# EAGLE design MD_digital2 (EAGLE 6.2)
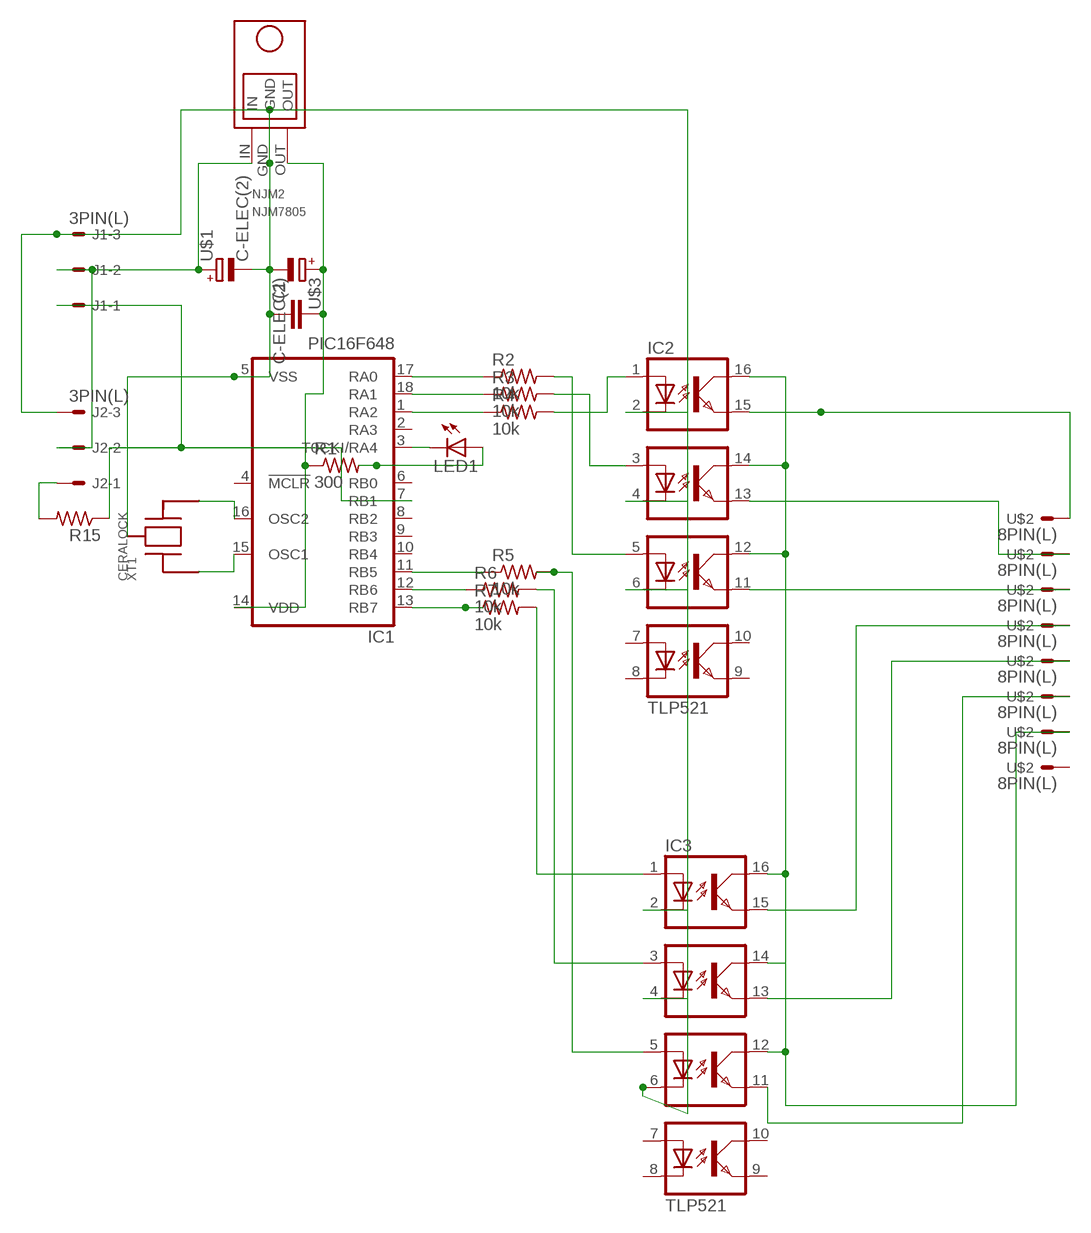
[diagram p0: schematic, sheet 1]

## Parts
C1  C-  [C-2.54]
IC1  PIC16F648  [DIL18]
IC2  TLP521  [DIL16]
IC3  TLP521  [DIL16]
J1  3PIN(L)  [3PL]
J2  3PIN(L)  [3PL]
LED1  LED  [LED5MM]
NJM2  NJM7805  [NJM7805]
R1  300  R-  [0207/10]
R2  10k  R-  [0207/10]
R3  10k  R-  [0207/10]
R4  10k  R-  [0207/10]
R5  10k  R-  [0207/10]
R6  10k  R-  [0207/10]
R7  10k  R-  [0207/10]
R15  R-  [0207/10]
U$1  C-ELEC(2)  [C-6MM(2)]
U$2  8PIN(L)  [8PL]
U$3  C-ELEC(2)  [C-6MM(2)]
XT1  CERALOCK  [CERALOCK]

## Nets
5V: C1.P$2 IC1.14(VDD) NJM2.OUT R1.1 U$3.+
9V: J1.2 J2.2 NJM2.IN U$1.+
12V: IC2.12(COL2) IC2.14(COL1) IC2.16(COL0) IC3.12(COL2) IC3.14(COL1) IC3.16(COL0) U$2.P7
FET_G2: IC3.11(EMIT2) U$2.P6
GND1: C1.P$1 IC1.5(VSS) IC2.2(C0) IC2.4(C1) IC2.6(C2) IC3.2(C0) IC3.4(C1) IC3.6(C2) J1.3 J2.3 NJM2.GND U$1.- U$3.- XT1.P2
LED_A: LED1.A R1.2
LED_C: IC1.3(T0CKI/RA4) LED1.K(C)
N$1: IC1.16(OSC2) XT1.P3
N$3: IC2.11(EMIT2) U$2.P3
N$4: J2.1 R15.2
N$7: IC1.15(OSC1) XT1.P1
N$10: IC1.17(RA0) R2.1
N$11: IC1.18(RA1) R3.1
N$12: IC1.1(RA2) R4.1
N$13: IC1.13(RB7) R7.1
N$14: IC1.12(RB6) R6.1
N$15: IC1.11(RB5) R5.1
N$16: IC2.5(A2) R2.2
N$17: IC2.3(A1) R3.2
N$18: IC2.1(A0) R4.2
N$19: IC3.1(A0) R7.2
N$20: IC3.3(A1) R6.2
N$21: IC3.5(A2) R5.2
N$23: IC2.15(EMIT0) U$2.P1
N$24: IC2.13(EMIT1) U$2.P2
N$25: IC3.15(EMIT0) U$2.P4
N$26: IC3.13(EMIT1) U$2.P5
SIGNAL: IC1.7(RB1) J1.1 R15.1
Unconnected: IC1.2(RA3) IC1.4(!MCLR) IC1.6(RB0) IC1.8(RB2) IC1.9(RB3) IC1.10(RB4) IC2.7(A3) IC2.8(C3) IC2.9(EMIT3) IC2.10(COL3) IC3.7(A3) IC3.8(C3) IC3.9(EMIT3) IC3.10(COL3) U$2.P8

## Library data of the parts
C1 = My_rcl:C-
IC1 = FP-21T for MITS:PIC16F648
IC2 IC3 = FP-21T for MITS:TLP521
J1 J2 = my_connector:3PIN(L)
LED1 = my_led:LED: LED
NJM2 = My_NJM7805:NJM7805
R1-R7 R15 = My_rcl:R-: Resistor
U$1 U$3 = My_rcl:C-ELEC(2)
U$2 = my_connector:8PIN(L)
XT1 = ceralock:CERALOCK

## Board
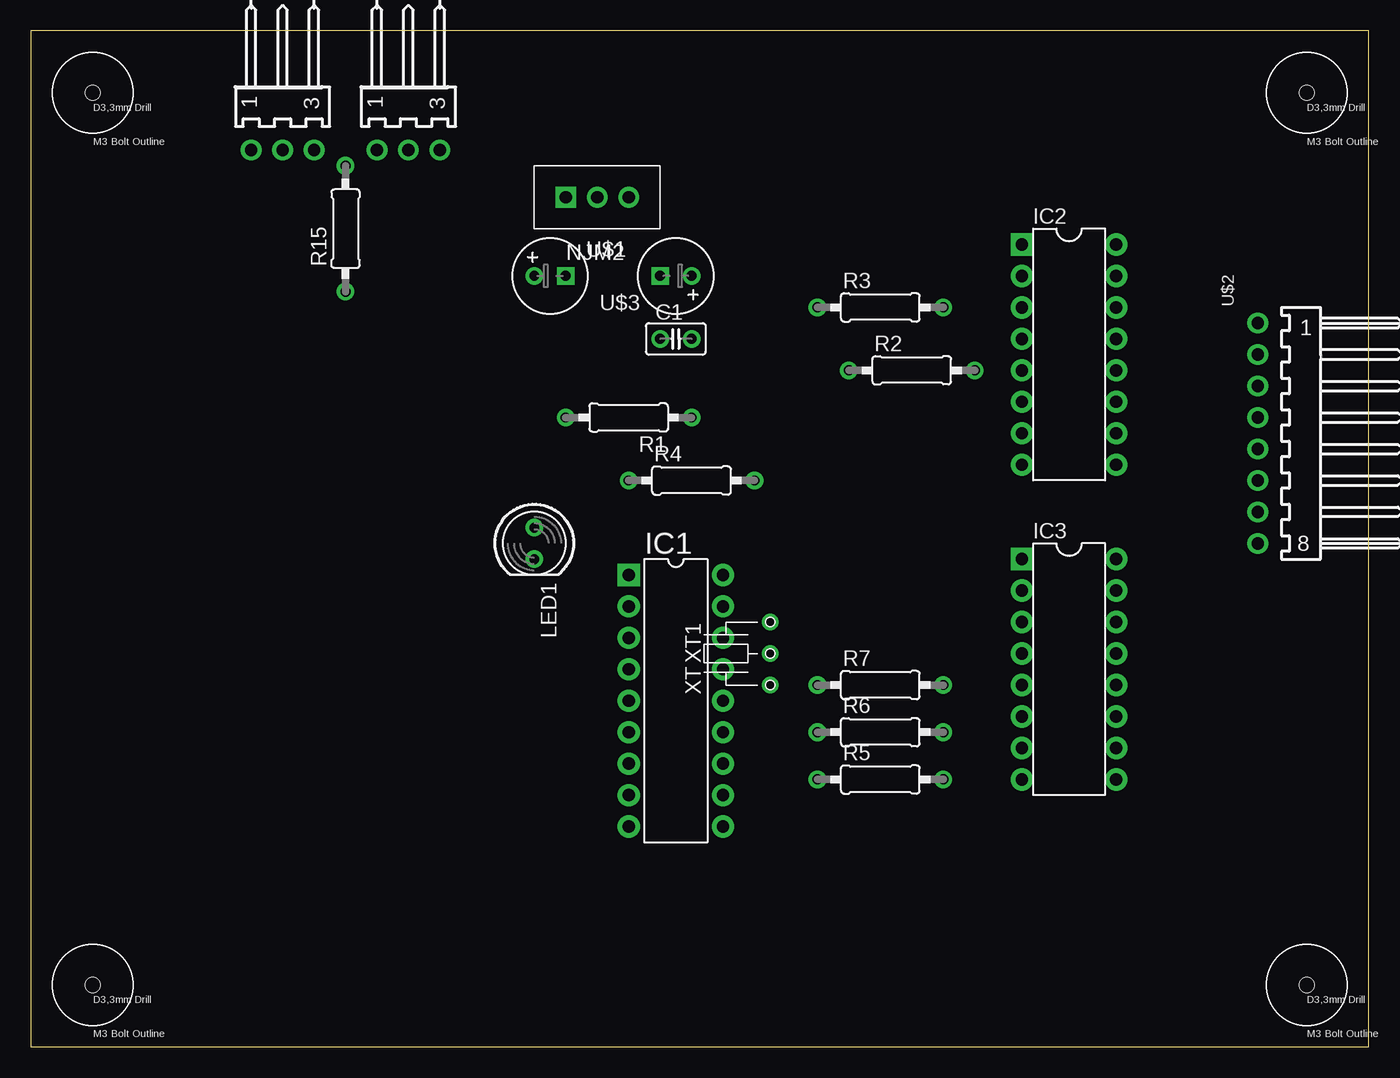
[diagram p1: board, top side]
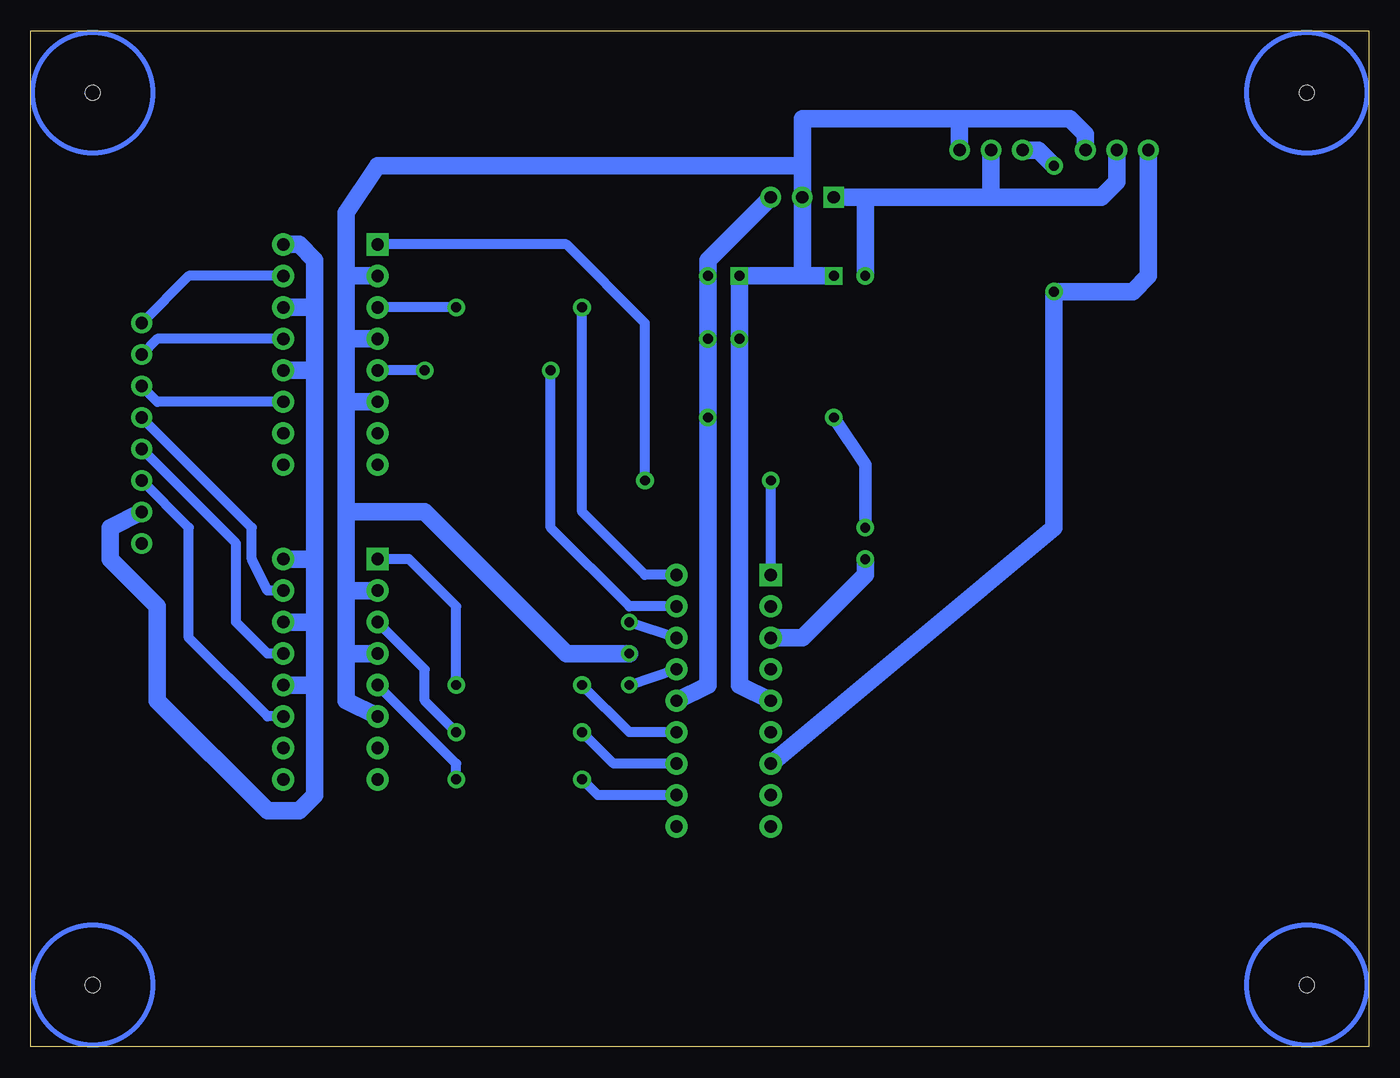
[diagram p2: board, bottom side, seen from below]

Size 108 x 82 mm. Coordinates in mm from the lower left corner, seen from the top.
Outline: 0,0 108,0 108,82 0,82 0,0
Copper layers (1*16): Top 0.035mm / dielectric 1.5mm / Bottom 0.035mm
Design rules: minimum track width 10mil, minimum drill 24mil, track to track 8mil, track to pad 8mil, pad to pad 8mil, via to via 8mil, smd to smd 8mil, copper to edge 40mil, drill to drill 8mil, minimum pad ring 10mil, minimum via ring 8mil, stop-mask expansion 4mil, vias tented up to drill 0mil, thermal gap 10mil

### Footprints (pad centres in the part's own frame; a part is rotated, then mirrored left to right if it is on the bottom)
C-2.54 = drill 0.8 pad 1.422: P$1 -1.27,0; P$2 1.27,0
HOLE3.3 = hole 1.2: 0,0
DIL18 = drill 1 pad 1.8 square: 1 -10.16,-3.81 | drill 1 pad 1.8: 2 -7.62,-3.81; 3 -5.08,-3.81; 4 -2.54,-3.81; 5 0,-3.81; 6 2.54,-3.81; 7 5.08,-3.81; 8 7.62,-3.81; 9 10.16,-3.81; 10 10.16,3.81; 11 7.62,3.81; 12 5.08,3.81; 13 2.54,3.81; 14 0,3.81; 15 -2.54,3.81; 16 -5.08,3.81; 17 -7.62,3.81; 18 -10.16,3.81
DIL16 = drill 1 pad 1.8 square: 1 -8.89,-3.81 | drill 1 pad 1.8: 2 -6.35,-3.81; 3 -3.81,-3.81; 4 -1.27,-3.81; 5 1.27,-3.81; 6 3.81,-3.81; 7 6.35,-3.81; 8 8.89,-3.81; 9 8.89,3.81; 10 6.35,3.81; 11 3.81,3.81; 12 1.27,3.81; 13 -1.27,3.81; 14 -3.81,3.81; 15 -6.35,3.81; 16 -8.89,3.81
3PL = drill 1 pad 1.676: 1 -2.54,-7.62; 2 0,-7.62; 3 2.54,-7.62
LED5MM = drill 0.8 pad 1.422: A -1.27,0; K 1.27,0
NJM7805 = drill 1 pad 1.676: GND 0,0; OUT 2.54,0 | drill 1 pad 1.676 square: IN -2.54,0
0207/10 = drill 0.8 pad 1.422: 1 -5.08,0; 2 5.08,0
C-6MM(2) = drill 0.8 pad 1.422: + -1.27,0 | drill 0.8 pad 1.422 square: - 1.27,0
8PL = drill 1 pad 1.676: P1 -8.89,-3.81; P2 -6.35,-3.81; P3 -3.81,-3.81; P4 -1.27,-3.81; P5 1.27,-3.81; P6 3.81,-3.81; P7 6.35,-3.81; P8 8.89,-3.81
CERALOCK = drill 0.8: P1 -2.54,-3.81; P2 0,-3.81; P3 2.54,-3.81

### Placement (x,y rotation side)
C1  52.07,57.15 0 top
H1  HOLE3.3M3BOLT  [HOLE3.3]  5,5 0 top
H2  HOLE3.3M3BOLT  [HOLE3.3]  103,5 0 top
H3  HOLE3.3M3BOLT  [HOLE3.3]  5,77 0 top
H4  HOLE3.3M3BOLT  [HOLE3.3]  103,77 0 top
IC1  52.07,27.94 270 top
IC2  83.82,55.88 270 top
IC3  83.82,30.48 270 top
J1  20.32,80.01 0 top
J2  30.48,80.01 0 top
LED1  40.64,40.64 270 top
NJM2  45.72,68.58 0 top
R1  48.26,50.8 180 top
R2  71.12,54.61 0 top
R3  68.58,59.69 0 top
R4  53.34,45.72 0 top
R5  68.58,21.59 0 top
R6  68.58,25.4 0 top
R7  68.58,29.21 0 top
R15  25.4,66.04 90 top
U$1  41.91,62.23 0 top
U$2  102.87,49.53 270 top
U$3  52.07,62.23 180 top
XT1  55.88,31.75 90 top

### Tracks (layer width: path | path; a pad name or v marks a point on that pad's centre or on a via)
5V
  Bottom 1.422: NJM2.OUT 53.34,63.5 U$3.+ | 53.34,60.96 U$3.+ | U$3.+ C1.P$2 R1.1 53.34,29.21 IC1.14
9V
  Bottom 1.422: J1.2 20.32,69.85 21.59,68.58 30.48,68.58 | 30.48,68.58 J2.2 | 30.48,68.58 40.64,68.58 | 40.64,68.58 U$1.+ | NJM2.IN 40.64,68.58
12V
  Bottom 1.422: IC2.16 86.36,64.77 85.09,63.5 85.09,59.69 | IC2.14 85.09,59.69 | 85.09,59.69 85.09,54.61 | IC2.12 85.09,54.61 | 85.09,54.61 85.09,39.37 | 85.09,39.37 85.09,34.29 | IC3.14 85.09,34.29 | 85.09,34.29 85.09,29.21 | 85.09,29.21 IC3.12 | IC3.16 85.09,39.37 | 85.09,29.21 85.09,20.32 86.36,19.05 88.9,19.05 97.79,27.94 97.79,35.56 101.6,39.37 101.6,41.91 U$2.P7
FET_G2
  Bottom 0.813: IC3.11 88.9,26.67 95.25,33.02 95.25,41.91 U$2.P6
GND1
  Bottom 1.422: J1.3 22.86,73.66 24.13,74.93 33.02,74.93 | 33.02,74.93 J2.3 | 45.72,71.12 45.72,74.93 33.02,74.93 | 45.72,62.23 NJM2.GND 45.72,71.12 | U$1.- 45.72,62.23 | IC1.5 50.8,29.21 C1.P$1 U$3.- 45.72,62.23 | 45.72,71.12 80.01,71.12 82.55,67.31 82.55,62.23 | IC2.2 82.55,62.23 | 82.55,62.23 82.55,57.15 | IC2.4 82.55,57.15 | 82.55,57.15 82.55,52.07 | IC2.6 82.55,52.07 | 82.55,52.07 82.55,43.18 | 82.55,43.18 82.55,36.83 | IC3.2 82.55,36.83 | 82.55,36.83 82.55,31.75 | 82.55,31.75 IC3.4 | IC3.6 82.55,27.94 82.55,31.75 | XT1.P2 64.77,31.75 76.2,43.18 82.55,43.18
LED_A
  Bottom 1.016: R1.2 40.64,46.99 LED1.A
LED_C
  Bottom 1.422: LED1.K 40.64,38.1 45.72,33.02 IC1.3
N$1
  Bottom 0.813: IC1.16 XT1.P3
N$3
  Bottom 0.813: IC2.11 97.79,52.07 U$2.P3
N$4
  Bottom 1.422: J2.1 26.67,72.39 R15.2
N$7
  Bottom 0.813: IC1.15 XT1.P1
N$10
  Bottom 0.813: IC1.17 59.69,35.56 66.04,41.91 R2.1
N$11
  Bottom 0.813: R3.1 63.5,43.18 58.42,38.1 IC1.18
N$12
  Bottom 0.813: IC1.1 R4.1
N$13
  Bottom 0.813: IC1.13 59.69,25.4 R7.1
N$14
  Bottom 0.813: IC1.12 60.96,22.86 R6.1
N$15
  Bottom 0.813: IC1.11 62.23,20.32 R5.1
N$16
  Bottom 0.813: R2.2 IC2.5
N$17
  Bottom 0.813: R3.2 IC2.3
N$18
  Bottom 0.813: R4.2 58.42,58.42 64.77,64.77 IC2.1
N$19
  Bottom 0.813: R7.2 73.66,35.56 77.47,39.37 IC3.1
N$20
  Bottom 0.813: R6.2 76.2,27.94 76.2,30.48 IC3.3
N$21
  Bottom 0.813: R5.2 73.66,22.86 IC3.5
N$23
  Bottom 0.813: IC2.15 95.25,62.23 U$2.P1
N$24
  Bottom 0.813: IC2.13 97.79,57.15 U$2.P2
N$25
  Bottom 0.813: IC3.15 88.9,36.83 90.17,39.37 90.17,41.91 U$2.P4
N$26
  Bottom 0.813: IC3.13 88.9,31.75 91.44,34.29 91.44,40.64 U$2.P5
SIGNAL
  Bottom 1.422: J1.1 17.78,62.23 19.05,60.96 R15.1 25.4,41.91 IC1.7
(copper drawn outside any net)
  shapes: Bottom circle x4